# EAGLE design rot_pcb_esp_10 (EAGLE 7.4.0)
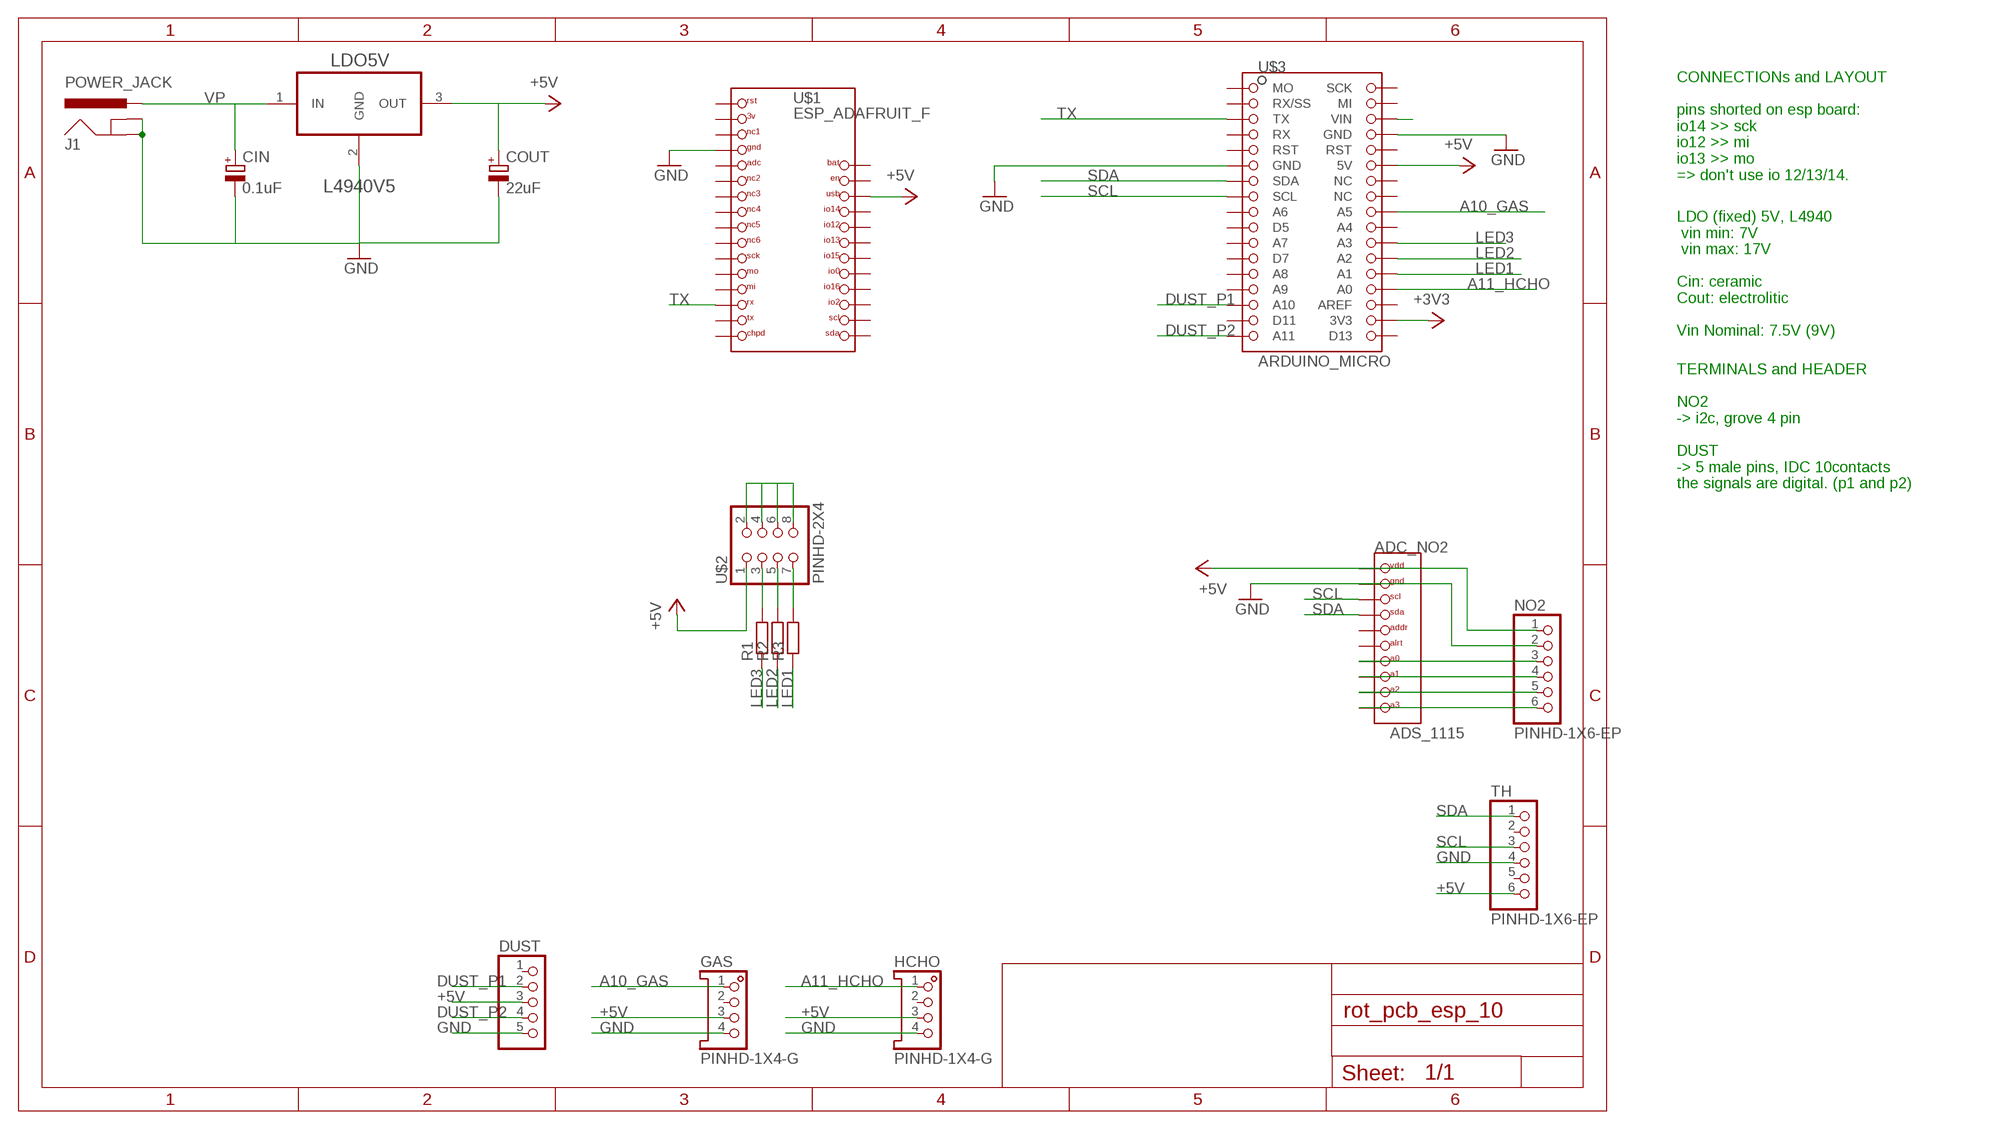
[diagram p0: schematic, sheet 1]

## Parts
ADC_NO2  ADS_1115  [ADS_1115]
CIN  0.1uF  CPOL-EUB45181B  [B45181B]
COUT  22uF  CPOL-EUE2-5  [E2-5]
DUST  PINHD-1X5  [1X5]
GAS  PINHD-1X4-G  [1X4_G]
HCHO  PINHD-1X4-G  [1X4_G]
J1  POWER_JACK  [POWER_JACK_PTH]
LDO5V  L4940V5  [TO254P482X1024X3124-3P]
NO2  PINHD-1X6-EP  [1X6]
R1  R-EU_0204/7  [0204/7]
R2  R-EU_0204/7  [0204/7]
R3  R-EU_0204/7  [0204/7]
TH  PINHD-1X6-EP  [1X6]
U$1  ESP_ADAFRUIT_F  [ESP_ADAFRUIT_F]
U$2  PINHD-2X4  [2X4]
U$3  ARDUINO_MICRO  [ARDUINO_MICRO]

## Nets
+3V3 [power]: U$3.3V3
+5V [power]: ADC_NO2.VDD COUT.+ DUST.3 GAS.3 HCHO.3 LDO5V.3(OUT) NO2.1 TH.6 U$1.USB U$2.1 U$3.5V
A10_GAS: GAS.1 U$3.A5
A11_HCHO: HCHO.1 U$3.A0
DUST_P1: DUST.2 U$3.A10
DUST_P2: DUST.4 U$3.A11
GND [power]: ADC_NO2.GND CIN.- COUT.- DUST.5 GAS.4 HCHO.4 J1.GND J1.GNDBREAK LDO5V.2(GND) NO2.2 TH.4 U$1.GND U$3.GND1(GND) U$3.GND2(GND)
LED1: R3.1 U$3.A1
LED2: R2.1 U$3.A2
LED3: R1.1 U$3.A3
N$1: ADC_NO2.A3 NO2.6
N$2: ADC_NO2.A2 NO2.5
N$3: U$3.VIN
N$4: ADC_NO2.A1 NO2.4
N$5: ADC_NO2.A0 NO2.3
N$6: R1.2 U$2.3
N$7: R2.2 U$2.5
N$8: R3.2 U$2.7
N$9: U$2.2 U$2.4 U$2.6 U$2.8
SCL: ADC_NO2.SCL TH.3 U$3.SCL
SDA: ADC_NO2.SDA TH.1 U$3.SDA
TX: U$1.RX U$3.TX
VP [power]: CIN.+ J1.PWR LDO5V.1(IN)
Unconnected: ADC_NO2.ADDR ADC_NO2.ALRT DUST.1 GAS.2 HCHO.2 TH.2 TH.5 U$1.ADC U$1.CHPD U$1.IO0 U$1.IO2 U$1.IO12 U$1.IO13 U$1.IO14 U$1.IO15 U$1.IO16 U$1.MI U$1.MO U$1.NC1 U$1.NC2 U$1.NC3 U$1.NC4 U$1.NC5 U$1.NC6 U$1.RST U$1.SCK U$1.SCL U$1.SDA U$1.TX U$3.A6 U$3.A7 U$3.A8 U$3.A9 U$3.D5 U$3.D7 U$3.D11 U$3.MO U$3.RST1(RST) U$3.RX U$3.SS(RX/SS)

## Notes on the sheet
- CONNECTIONs and LAYOUT
  
  pins shorted on esp board:
  io14 >> sck
  io12 >> mi
  io13 >> mo
  => don't use io 12/13/14.
- LDO (fixed) 5V, L4940
   vin min: 7V
   vin max: 17V
  
  Cin: ceramic
  Cout: electrolitic
  
  Vin Nominal: 7.5V (9V)
- TERMINALS and HEADER
  
  NO2
  -> i2c, grove 4 pin
  
  DUST
  -> 5 male pins, IDC 10contacts
  the signals are digital. (p1 and p2)

## Power pins joined to a net without a drawn wire
3V: U$1.3V
A4: U$3.A4
AREF: U$3.AREF
BAT: U$1.BAT
D13: U$3.D13
EN: U$1.EN
MI: U$3.MI
NC: U$3.NC1(NC) U$3.NC2(NC)
RST: U$3.RST2(RST)
SCK: U$3.SCK

## Library data of the parts
ADC_NO2 = ep:ADS_1115
CIN COUT = rcl:CPOL-EU: POLARIZED CAPACITOR, European symbol
DUST = ep:PINHD-1X5: PIN HEADER
GAS HCHO = ep:PINHD-1X4-G
J1 = ep:POWER_JACK: Power Jack Connector This is the standard 5.5mm barrel jack for power. The PTH is the most common, proven, reliable, footprint. The Slot footprint only works if the mill layer is transmitted to the PCB fab house so be warned. Here are the connectors we sell at SparkFun: DC Barrel Power Jack/Connector <https://www.sparkfun.com/products/119> (PRT-00119) DC Barrel Power Jack/Connector (SMD) <https://www.sparkfun.com/products/12748> (PRT-12748) DC Barrel Jack Adapter - Breadboard Compatible <https://www.sparkfun.com/products/10811> (PRT-10811) It is used on this SparkFun product (and many, many others): SparkFun RedBoard - Programmed with Arduino <https://www.sparkfun.com/products/12757> (DEV-12757) Also, if you need a mating power supply or connector, please check these out: Wall Adapter Power Supply - 9VDC 650mA <https://www.sparkfun.com/products/298> (TOL-00298) DC Barrel Jack Adapter - Male <https://www.sparkfun.com/products/10287> (PRT-10287); PROD_ID: CONN-08197
LDO5V = ldo_5v:L4940V5: IC, V REG LDO +5.0V, 4940, TO-220-3; MPN: L4940V5; OC_FARNELL: 9756060; OC_NEWARK: 89K0746; PACKAGE: TO-220-3; SUPPLIER: STMicroelectronics
NO2 TH = ep:PINHD-1X6-EP
R1-R3 = rcl:R-EU_: RESISTOR, European symbol
U$1 = ep:ESP_ADAFRUIT_F
U$2 = ep:PINHD-2X4
U$3 = ep:ARDUINO_MICRO

## Net classes
0 default: width 0.3 mm, drill 0.85 mm
1 power: width 0.61 mm, drill 0.85 mm

## Board
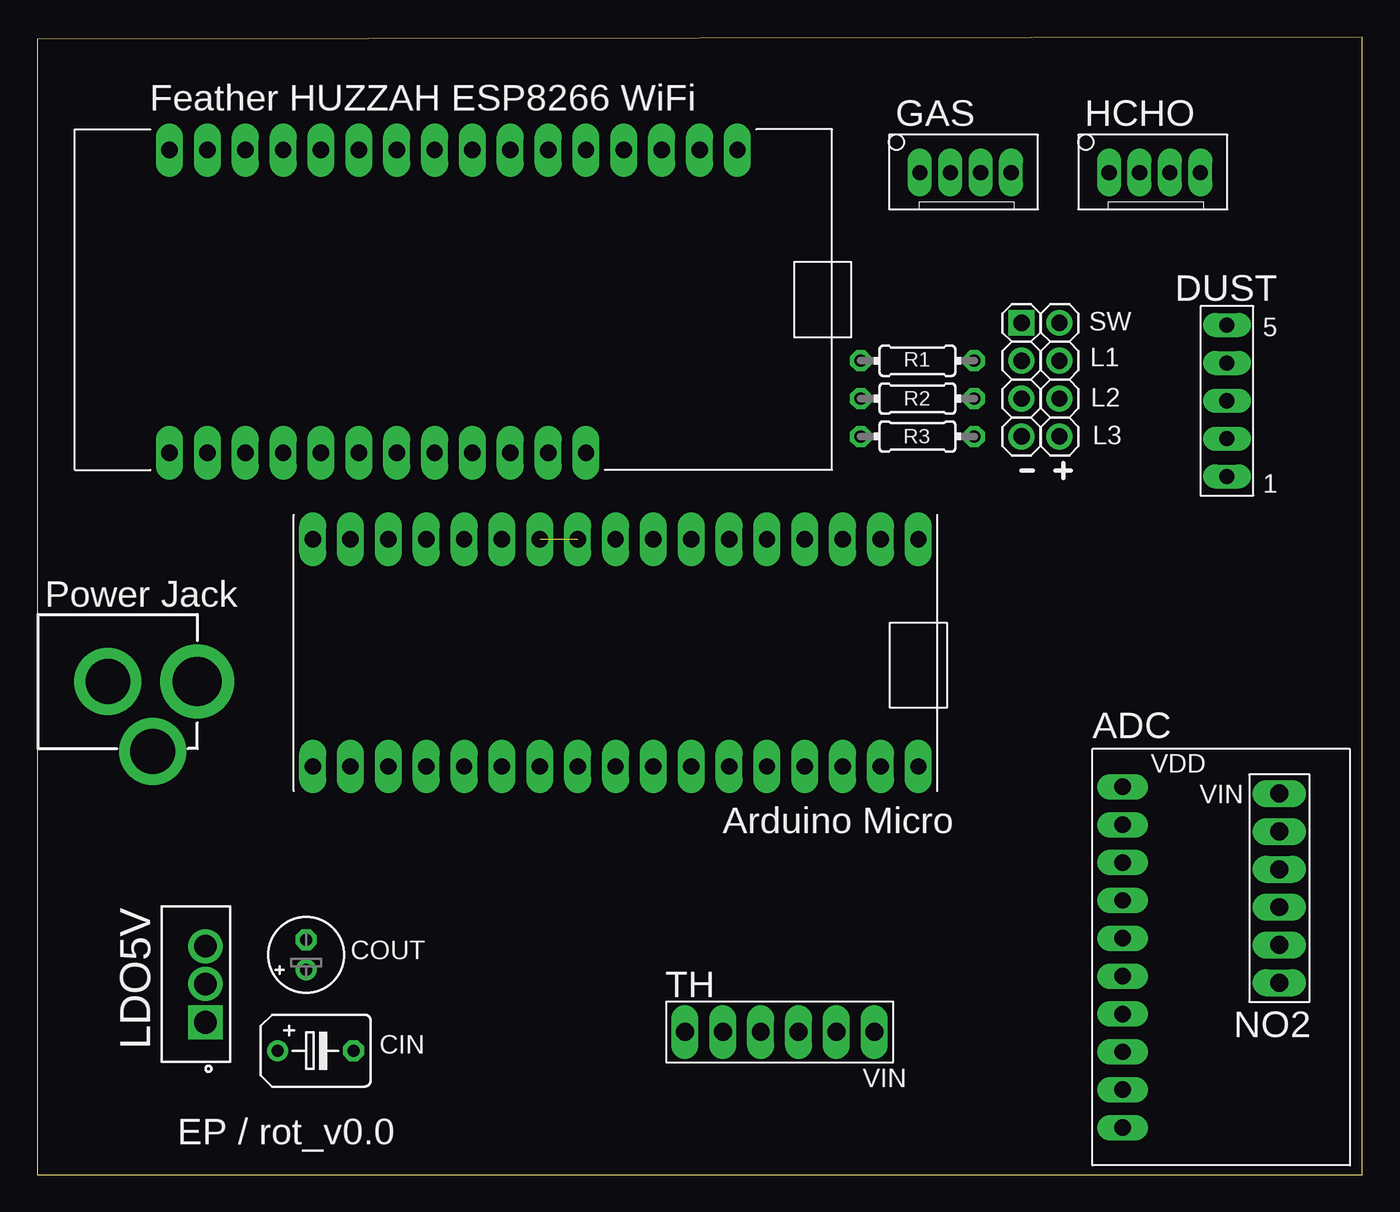
[diagram p1: board, top side]
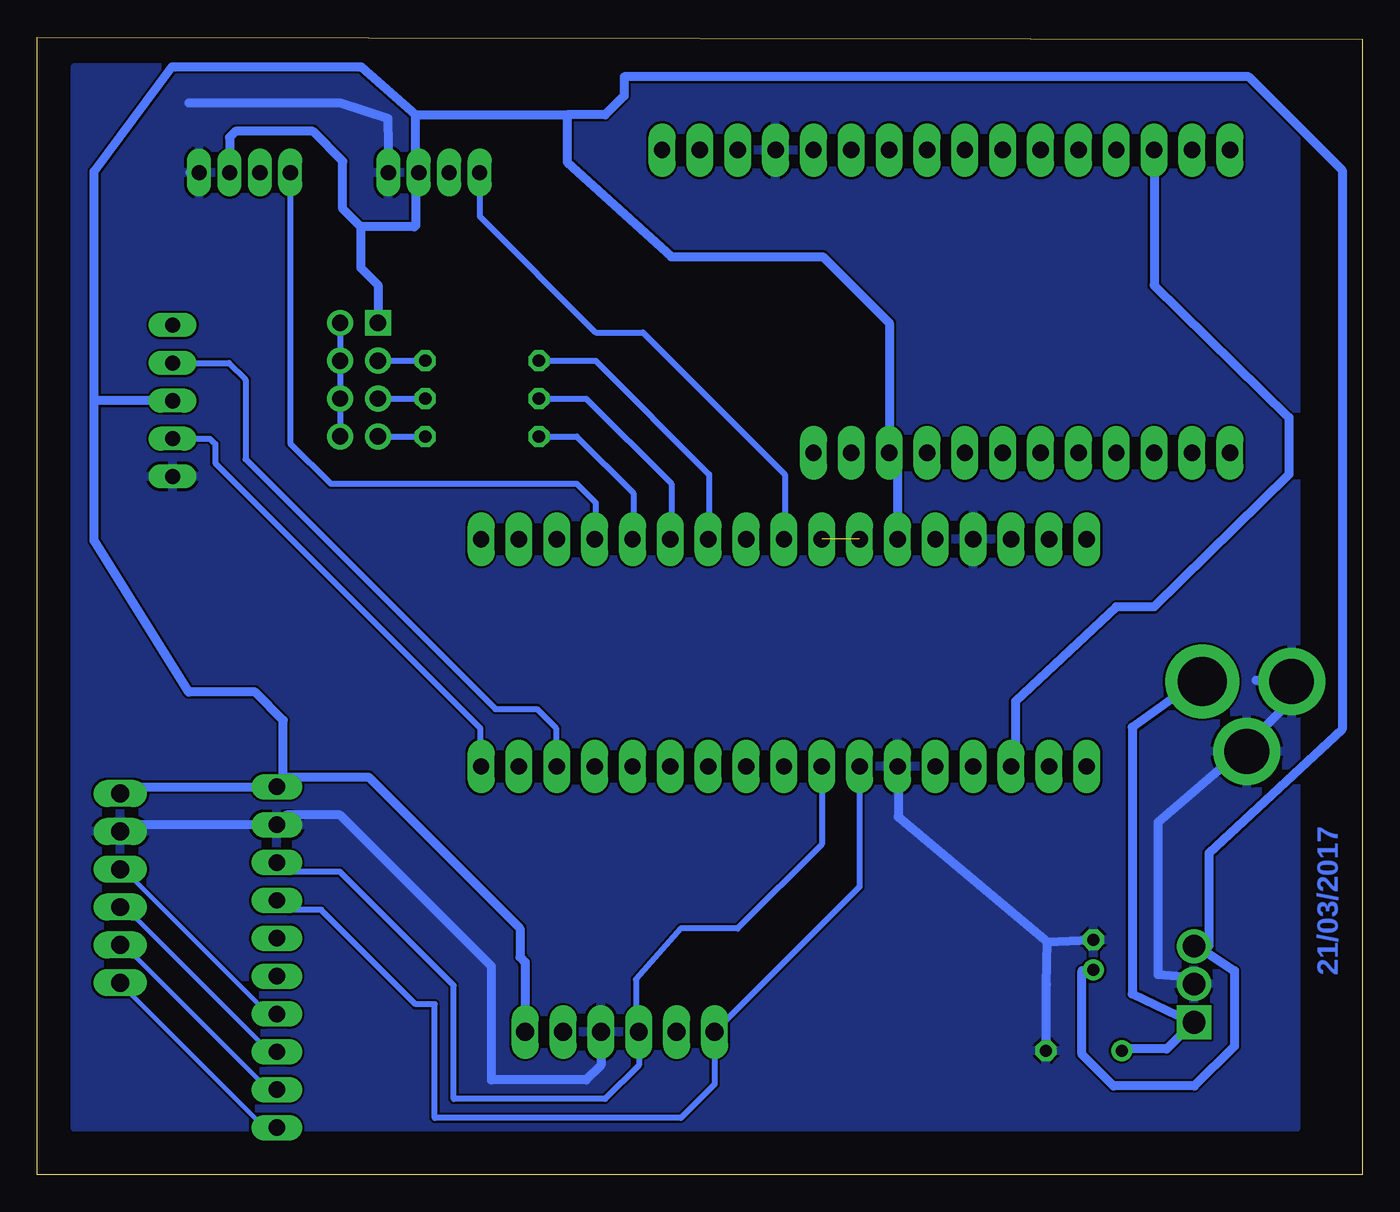
[diagram p2: board, bottom side, seen from below]

Size 88.9 x 76.32 mm. Coordinates in mm from the lower left corner, seen from the top.
Outline: 0,0 88.9,0 88.9,76.32 0,76.19 0,0
Copper layers 16: Bottom 0.035mm
Design rules "eC_1Layer_PClass6_BaseCopperO35_eCDefault": minimum track width 0.15mm, minimum drill 0.35mm, track to track 0.15mm, track to pad 0.15mm, pad to pad 0.15mm, via to via 0.15mm, smd to smd 0mil, copper to edge 0.25mm, drill to drill 0.35mm, minimum pad ring 0.3mm, minimum via ring 0.3mm, stop-mask expansion 0mil, vias tented up to drill 0.45mm, thermal gap 0.2mm

### Footprints (pad centres in the part's own frame; a part is rotated, then mirrored left to right if it is on the bottom)
ADS_1115 = drill 1.1 pad 1.422 long: A0 17.78,2.032; A1 20.32,2.032; A2 22.86,2.032; A3 25.4,2.032; ADDR 12.7,2.032; ALRT 15.24,2.032; GND 5.08,2.032; SCL 7.62,2.032; SDA 10.16,2.032; VDD 2.54,2.032
B45181B = drill 0.813: + -2.54,0 | drill 0.813 octagon: - 2.54,0
E2-5 = drill 0.813 pad 1.27: + -1.016,0 | drill 0.813 pad 1.27 octagon: - 1.016,0
1X5 = drill 1.016 long: 1 1.27,1.27; 2 3.81,1.27; 3 6.35,1.27; 4 8.89,1.27; 5 11.43,1.27
1X4_G = drill 1.016 long: 1 2.07,2.47; 2 4.11,2.47; 3 6.15,2.47; 4 8.19,2.47
POWER_JACK_PTH = drill 2.997 pad 4.318: GND -0.076,4.779; GNDBREAK 4.624,7.779 | drill 3.3 pad 4.6: PWR -0.076,10.779
TO254P482X1024X3124-3P = drill 1.524 square: 1 -5.105,-1.295 | drill 1.524: 2 -2.54,-1.295; 3 0,-1.295
1X6 = drill 1.2 long: 1 1.27,1.27; 2 3.81,1.27; 3 6.35,1.27; 4 8.89,1.27; 5 11.43,1.27; 6 13.97,1.27
0204/7 = drill 0.813 octagon: 1 -3.81,0; 2 3.81,0
ESP_ADAFRUIT_F = drill 1.1 pad 1.8 long: 3V 8.89,1.397; ADC 16.51,1.397; BAT 16.51,21.717; CHPD 44.45,1.397; EN 19.05,21.717; GND 13.97,1.397; IO0 34.29,21.717; IO2 39.37,21.717; IO12 26.67,21.717; IO13 29.21,21.717; IO14 24.13,21.717; IO15 31.75,21.717; IO16 36.83,21.717; MI 36.83,1.397; MO 34.29,1.397; NC1 11.43,1.397; NC2 19.05,1.397; NC3 21.59,1.397; NC4 24.13,1.397; NC5 26.67,1.397; NC6 29.21,1.397; RST 6.35,1.397; RX 39.37,1.397; SCK 31.75,1.397; SCL 41.91,21.717; SDA 44.45,21.717; TX 41.91,1.397; USB 21.59,21.717
2X4 = drill 1.1 pad 1.738 square: 1 1.27,1.27 | drill 1.1 pad 1.738: 2 1.27,3.81; 3 3.81,1.27; 4 3.81,3.81; 5 6.35,1.27; 6 6.35,3.81; 7 8.89,1.27; 8 8.89,3.81
ARDUINO_MICRO = drill 1.1 pad 1.8 long: 3V3 3.81,1.397; 5V 29.21,1.397; A0 8.89,1.397; A1 11.43,1.397; A2 13.97,1.397; A3 16.51,1.397; A4 19.05,1.397; A5 21.59,1.397; A6 21.59,16.637; A7 16.51,16.637; A8 11.43,16.637; A9 8.89,16.637; A10 6.35,16.637; A11 1.27,16.637; AREF 6.35,1.397; D5 19.05,16.637; D7 13.97,16.637; D11 3.81,16.637; D13 1.27,1.397; GND1 29.21,16.637; GND2 34.29,1.397; MI 39.37,1.397; MO 41.91,16.637; NC1 26.67,1.397; NC2 24.13,1.397; RST1 31.75,16.637; RST2 31.75,1.397; RX 34.29,16.637; SCK 41.91,1.397; SCL 24.13,16.637; SDA 26.67,16.637; SS 39.37,16.637; TX 36.83,16.637; VIN 36.83,1.397

### Placement (x,y rotation side)
ADC_NO2  70.8,28.56 270 top
CIN  18.68,8.32 0 top
COUT  18.04,14.75 90 top
DUST  78.56,58.27 270 top
GAS  57.15,64.77 0 top
HCHO  69.85,64.77 0 top
J1  -0.04,33.02 270 top
LDO5V  9.99,15.33 90 top
NO2  82.07,26.84 270 top
R1  59.05,54.61 0 top
R2  59.05,52.07 0 top
R3  59.05,49.53 0 top
TH  42.19,8.3 0 top
U$1  53.33,70.14 180 top
U$2  64.77,58.42 270 top
U$3  60.39,44.03 180 top

### Tracks (layer width: path | path; a pad name or v marks a point on that pad's centre or on a via)
+5V
  Bottom 0.61: ADC_NO2.VDD 72.18,26.67 66.67,26.67 56.51,16.51 56.51,14.61 56.16,14.25 TH.6 | NO2.1 82.89,26.02 ADC_NO2.VDD | ADC_NO2.VDD 72.39,26.46 72.39,30.48 74.3,32.38 78.74,32.38 85.09,42.54 85.09,52.07 | COUT.+ 18.8,13.69 18.8,8.06 16.69,5.95 11.25,5.95 8.58,8.62 8.58,13.69 10.88,15.19 11.25,15.19 LDO5V.3 10.29,15.38 10.29,21.56 1.35,29.89 1.35,67.39 7.62,73.66 49.53,73.66 49.53,72.39 50.8,71.12 53.34,71.12 | GAS.3 63.5,67.24 | 63.5,67.24 63.5,71.12 | 63.5,71.12 53.34,71.12 | 53.34,71.12 53.34,67.95 46.35,61.59 36.2,61.59 31.74,57.14 U$1.USB 31.18,47.86 U$3.5V 31.18,41.91 | 63.5,67.24 63.5,63.7 63.6,63.6 67.2,63.6 | 67.2,63.6 68.4,64.8 68.4,68 70.4,70 75.6,70 76,69.6 HCHO.3 | 67.2,63.6 67.2,60.85 66.04,59.69 U$2.1 | 85.09,52.07 85.09,67.31 79.86,74.33 67.16,74.33 63.5,71.12 | DUST.3 84.95,51.92 85.09,52.07
A10_GAS
  Bottom 0.406: GAS.1 59.22,64.3 51.43,56.51 48.26,56.51 38.73,46.99 38.73,42.7 U$3.A5
A11_HCHO
  Bottom 0.406: HCHO.1 71.92,49.06 69.22,46.35 52.7,46.35 51.43,45.08 51.43,42.7 U$3.A0
DUST_P1
  Bottom 0.406: DUST.2 76.06,54.46 74.93,53.34 74.93,48.01 58.17,31.24 55.37,31.24 54.1,29.97 54.1,27.46 U$3.A10
DUST_P2
  Bottom 0.406: DUST.4 77.33,49.38 76.96,49.02 76.96,47.75 59.18,29.97 59.18,27.46 U$3.A11
GND
  Bottom 0.61: TH.4 51.08,7.34 52.07,6.35 58.42,6.35 58.42,13.97 68.58,24.13 72.18,24.13 ADC_NO2.GND 82.89,23.48 NO2.2 | HCHO.4 78.67,67.24 | 78.74,71.92 68.58,71.92 65.38,70.88 GAS.4 | LDO5V.2 11.44,12.94 11.81,13.31 12,13.31 13.71,13.43 13.71,23.65 8.25,28.31 J1.GNDBREAK 8.06,28.5 5.25,31.31 5.25,33 J1.GND 5.44,33.19 7.12,33.19 | 21.12,15.61 21.19,12.75 21.19,8.44 CIN.- | 21.12,15.61 18.19,15.75 COUT.- | 26.25,41.81 26.25,42.56 U$3.GND2 | 21.12,15.61 31.13,24.01 31.13,27.38 U$3.GND1
  pour Bottom (isolate 0.15, rank 2): 4.45,3.18 86.36,3.18 86.36,74.3 4.45,74.3
LED1
  Bottom 0.406: R3.1 52.7,49.53 48.89,45.72 48.89,42.7 U$3.A1
LED2
  Bottom 0.406: R2.1 52.07,52.07 46.35,46.35 46.35,42.7 U$3.A2
LED3
  Bottom 0.406: R1.1 51.43,54.61 43.81,46.99 43.81,42.7 U$3.A3
N$1
  Bottom 0.3: ADC_NO2.A3 72.94,3.19 73.69,3.19 83.25,12.75 NO2.6
N$2
  Bottom 0.3: ADC_NO2.A2 72.94,5.81 73.5,5.81 83.25,15.56 NO2.5
N$4
  Bottom 0.3: ADC_NO2.A1 72.94,8.25 73.31,8.25 82.88,17.81 83.25,17.81 NO2.4
N$5
  Bottom 0.3: ADC_NO2.A0 72.94,10.88 73.5,10.88 83.25,20.62 NO2.3
N$6
  Bottom 0.406: U$2.3 R1.2
N$7
  Bottom 0.406: U$2.5 R2.2
N$8
  Bottom 0.406: U$2.7 R3.2
N$9
  Bottom 0.406: U$2.2 U$2.4 U$2.6 U$2.8
NC  (1 unrouted)
SCL
  Bottom 0.406: U$3.SCL 36.26,22.16 41.91,16.51 45.72,16.51 48.73,13.1 48.73,10.96 TH.3 48.54,7.34 50.8,5.08 60.96,5.08 60.96,12.7 68.58,20.32 72.21,20.32 ADC_NO2.SCL
SDA
  Bottom 0.406: U$3.SDA 33.72,19.31 TH.1 43.46,6.07 45.72,3.81 62.23,3.81 62.23,11.43 63.5,11.43 69.85,17.78 72.21,17.78 ADC_NO2.SDA
TX
  Bottom 0.61: U$1.RX 13.96,59.7 13.97,59.69 4.91,50.8 4.91,46.99 13.97,38.1 16.51,38.1 23.26,31.75 23.26,28.09 U$3.TX
VP
  Bottom 0.61: CIN.+ 16.12,8.44 13.12,8.44 11.44,10.12 LDO5V.1 11.62,10.31 15.44,12.12 15.44,30.01 11.25,33 J1.PWR

### Text on the board
Bottom: 21/03/2017
tPlace: Feather HUZZAH ESP8266 WiFi | SW | 5 | L1 | L2 | L3 | 1 | Power Jack | ADC | VDD | VIN | Arduino Micro | COUT | VIN | EP / rot_v0.0